# Altium schematic sheet PLD_RadFET_LCL.SchDoc: Local Supply
size A4; SheetTotal: 32
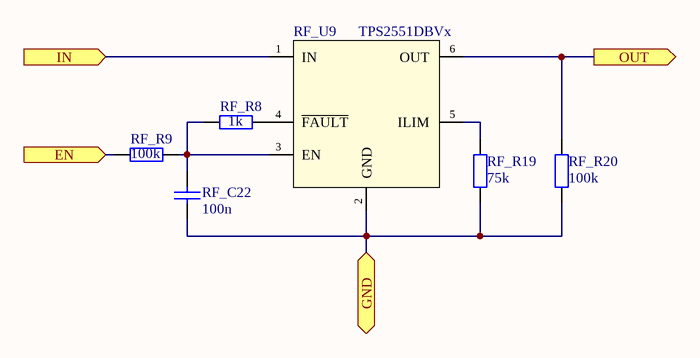
[diagram p0: PLD_RadFET_LCL.SchDoc]

## Parts
RF_C22  value 100n  [SMD_Capacitor_0603]  (hidden comment: Cap)
RF_R8  1k  [SMD_Resistor_0603]
RF_R9  100k  [SMD_Resistor_0603]
RF_R19  75k  [SMD_Resistor_0603]
RF_R20  100k  [SMD_Resistor_0603]
RF_U9  TPS2551DBVx  [SOT23-6]

## Ports
EN (in), GND, IN (in), OUT (out)

## Nets
EN: RF_R9.2 ; port EN
GND: RF_C22.2 RF_R19.1 RF_R20.1 RF_U9.2(GND) ; port GND
IN: RF_U9.1(IN) ; port IN
OUT: RF_R20.2 RF_U9.6(OUT) ; port OUT
NetRF_C22_1: RF_C22.1 RF_R8.2 RF_R9.1 RF_U9.3(EN)
NetRF_R8_1: RF_R8.1 RF_U9.4(~{FAULT})
NetRF_R19_2: RF_R19.2 RF_U9.5(ILIM)

## Notes on the sheet
- Title:
- Project:
- Author:
- Model:
- Document Number:
- Checked by:
- Rev:
- Date:
- Approved by:
- Sheet:
- of
- File name:

## Library data of the parts
RF_R8 RF_R9 RF_R19 RF_R20 = Res: Package: 0603
  RF_R8: Value: 1k
  RF_R9 RF_R20: Value: 100k
  RF_R19: Value: 75k
RF_U9 = TPS2551DBVx: Adjustable Current-Limited Power-Distribution Switch.; Manufacturer: Texas Instruments; Value: TPS2551DBVx
RF_C22 = Cap: Package: 0603